# Altium schematic sheet CONTROL_BOARD.SchDoc
size 1249 x 800 mm; SheetNumber: 1; SheetTotal: 1
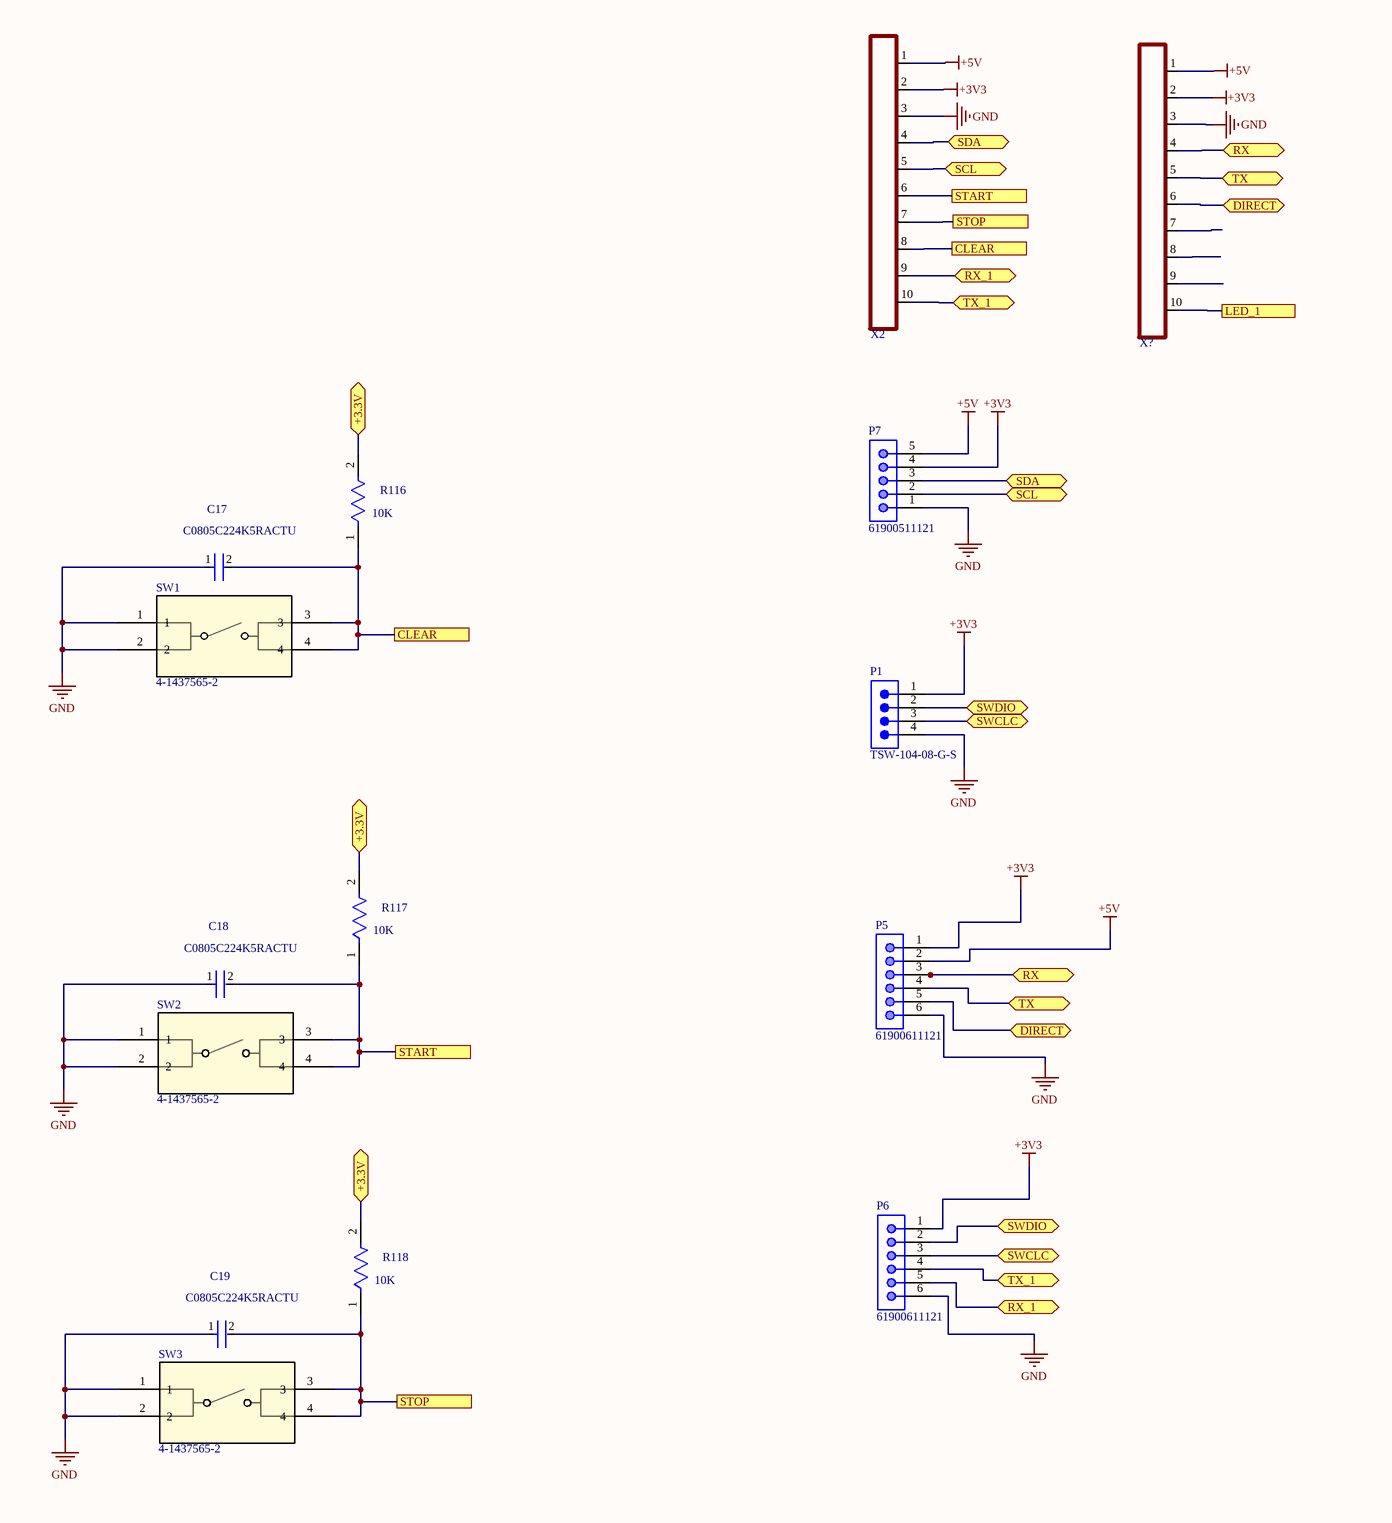
[diagram p0: CONTROL_BOARD.SchDoc, left]
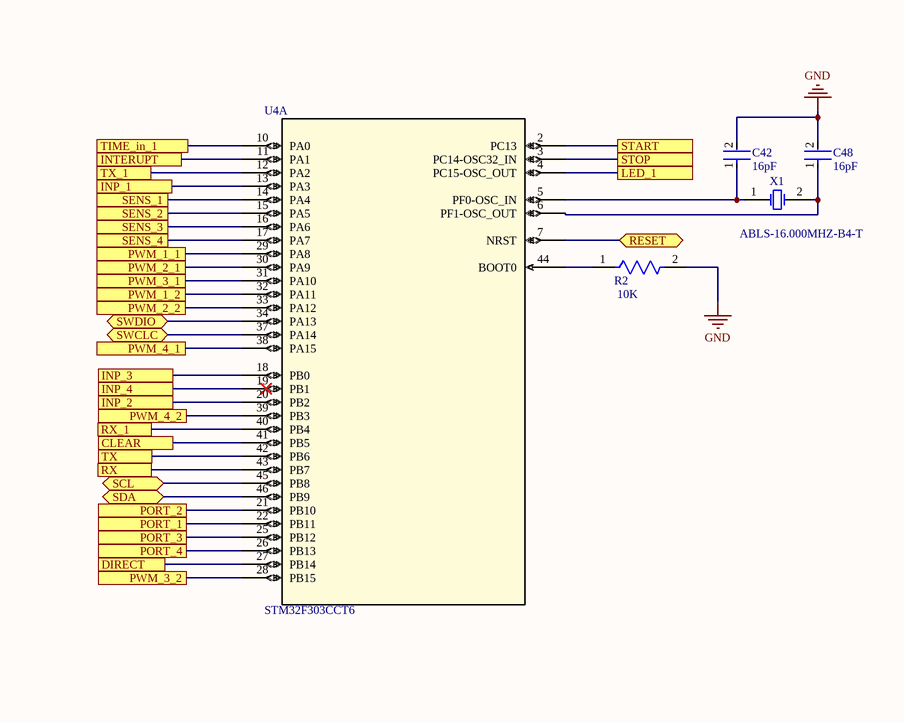
[diagram p1: CONTROL_BOARD.SchDoc, right]

## Parts
C17  C0805C224K5RACTU  [FP-C0805C-DN-IPC_A]
C18  C0805C224K5RACTU  [FP-C0805C-DN-IPC_A]
C19  C0805C224K5RACTU  [FP-C0805C-DN-IPC_A]
C42  16pF  [FP-C0805C-DN-MFG]
C48  16pF  [FP-C0805C-DN-MFG]
P1  TSW-104-08-G-S  [SMTC-TSW-104-08-X-S]
P5  61900611121  [61900611121]
P6  61900611121  [61900611121]
P7  61900511121  [61900511121]
R2  10K  [Vishay_CRCW0805-e3_IPC_A]
R116  10K  [FP-CRCW0805-e3-IPC_A]
R117  10K  [FP-CRCW0805-e3-IPC_A]
R118  10K  [FP-CRCW0805-e3-IPC_A]
SW1  4-1437565-2  [SW4_FSM-5P23_TEC]
SW2  4-1437565-2  [SW4_FSM-5P23_TEC]
SW3  4-1437565-2  [SW4_FSM-5P23_TEC]
U4  STM32F303CCT6  [LQFP48-7x7mm]  (part A of 2)
X1  ABLS-16.000MHZ-B4-T  [ABRA-ABLS-14.7456MHZ-B2-T_V]
X2  BH-10  [BH-10]  (value not drawn)
X?  BH-10  [BH-10]  (value not drawn)

## Ports
+3.3V (bidir), CLEAR, DIRECT, DIRECT (bidir), INP_1, INP_2, INP_3, INP_4, INTERUPT, LED_1, PORT_1, PORT_2, PORT_3, PORT_4, PWM_1_1, PWM_1_2, PWM_2_1, PWM_2_2, PWM_3_1, PWM_3_2, PWM_4_1, PWM_4_2, RESET (bidir), RX, RX (bidir), RX_1, RX_1 (bidir), SCL (bidir), SDA (bidir), SENS_1, SENS_2, SENS_3, SENS_4, START, STOP, SWCLC (bidir), SWDIO (bidir), TIME_in_1, TX, TX (bidir), TX_1, TX_1 (bidir)

## Nets
+3V3: P1.1 P5.1 P6.1 P7.4 X2.2 X?.2
+5V: P5.2 P7.5 X2.1 X?.1
GND: C17.1 C18.1 C19.1 C42.2 C48.2 P1.4 P5.6 P6.6 P7.1 R2.2 SW1.1 SW1.2 SW2.1 SW2.2 SW3.1 SW3.2 X2.3 X?.3
+3.3V: R116.2 R117.2 R118.2 ; port +3.3V
CLEAR: C17.2 R116.1 SW1.3 SW1.4 U4.41(PB5) X2.8 ; port CLEAR
DIRECT: P5.5 U4.27(PB14) X?.6 ; port DIRECT
INP_1: U4.13(PA3) ; port INP_1
INP_2: U4.20(PB2) ; port INP_2
INP_3: U4.18(PB0) ; port INP_3
INP_4: U4.19(PB1) ; port INP_4
INTERUPT: U4.11(PA1) ; port INTERUPT
LED_1: U4.4(PC15-OSC_OUT) X?.10 ; port LED_1
PORT_1: U4.22(PB11) ; port PORT_1
PORT_2: U4.21(PB10) ; port PORT_2
PORT_3: U4.25(PB12) ; port PORT_3
PORT_4: U4.26(PB13) ; port PORT_4
PWM_1_1: U4.29(PA8) ; port PWM_1_1
PWM_1_2: U4.32(PA11) ; port PWM_1_2
PWM_2_1: U4.30(PA9) ; port PWM_2_1
PWM_2_2: U4.33(PA12) ; port PWM_2_2
PWM_3_1: U4.31(PA10) ; port PWM_3_1
PWM_3_2: U4.28(PB15) ; port PWM_3_2
PWM_4_1: U4.38(PA15) ; port PWM_4_1
PWM_4_2: U4.39(PB3) ; port PWM_4_2
RESET: U4.7(NRST) ; port RESET
RX: P5.3 U4.43(PB7) X?.4 ; port RX
RX_1: P6.5 U4.40(PB4) X2.9 ; port RX_1
SCL: P7.2 U4.45(PB8) X2.5 ; port SCL
SDA: P7.3 U4.46(PB9) X2.4 ; port SDA
SENS_1: U4.14(PA4) ; port SENS_1
SENS_2: U4.15(PA5) ; port SENS_2
SENS_3: U4.16(PA6) ; port SENS_3
SENS_4: U4.17(PA7) ; port SENS_4
START: C18.2 R117.1 SW2.3 SW2.4 U4.2(PC13) X2.6 ; port START
STOP: C19.2 R118.1 SW3.3 SW3.4 U4.3(PC14-OSC32_IN) X2.7 ; port STOP
SWCLC: P1.3 P6.3 U4.37(PA14) ; port SWCLC
SWDIO: P1.2 P6.2 U4.34(PA13) ; port SWDIO
TIME_in_1: U4.10(PA0) ; port TIME_in_1
TX: P5.4 U4.42(PB6) X?.5 ; port TX
TX_1: P6.4 U4.12(PA2) X2.10 ; port TX_1
NetC42_1: C42.1 U4.5(PF0-OSC_IN) X1.1(X1)
NetC48_1: C48.1 U4.6(PF1-OSC_OUT) X1.2(X2)
NetR2_1: R2.1 U4.44(BOOT0)

Not connected (* = marked no-connect by the designer): X? 7 8 9

## Library data of the parts
C17-C19 = CMP-1036-04552-2: CAP CER 0.22UF 50V X7R 0805; Manufacturer: KEMET; Value: 0.22 μF; Temperature Coefficient: 30ppm/°C; Material: Ceramic; Tolerance: 0.1; ComponentLink2URL: https://content.kemet.com/datasheets/KEM_C1003_C0G_SMD.pdf; Temperature Characteristic: X7R; Device Class L3: Ceramic Capacitors; Lead Free: Yes; Temperature: -55°C to +125°C; RoHS: TRUE; Capacitance: 0.22 μF; Automotive: No; Octopart: https://octopart.com/c0805c224k5ractu-kemet-144670; Manufacturer Part Number: C0805C224K5RACTU; Temperature Range Low: -55°C; Height: 0.88mm; Device Class L1: Passive Components; Digikey Description: CAP CER 0.22UF 50V X7R 0805; ComponentLink2Description: Datasheet; Mouser Description: CAP CER 0.22UF 50V X7R 0805; Category: Cap; Ipc Land Pattern Name: CAPC200125X78; Temperature Range High: +125°C; Package: C0805C-DN; Device Class L2: Capacitors; Voltage Rating: 50 V
C42 C48 = CMP-1036-04552-2: CAP CER 16pF 50V X7R 0805; Manufacturer: KEMET; Manufacturer Part Number: C0805C224K5RACTU; Value: 0.22 μF; Temperature Coefficient: 30ppm/°C; Material: Ceramic; Tolerance: 0.1; ComponentLink2URL: https://content.kemet.com/datasheets/KEM_C1003_C0G_SMD.pdf; Temperature Characteristic: X7R; Device Class L3: Ceramic Capacitors; Lead Free: Yes; Temperature: -55°C to +125°C; RoHS: TRUE; Capacitance: 0.22 μF; Automotive: No; Octopart: https://octopart.com/c0805c224k5ractu-kemet-144670; Temperature Range Low: -55°C; Height: 0.88mm; Device Class L1: Passive Components; Digikey Description: CAP CER 0.22UF 50V X7R 0805; ComponentLink2Description: Datasheet; Mouser Description: CAP CER 0.22UF 50V X7R 0805; Category: Cap; Ipc Land Pattern Name: CAPC200125X78; Temperature Range High: +125°C; Package: C0805C-DN; Device Class L2: Capacitors; Voltage Rating: 50 V
P1 = CMP-1024-00357-1: 0.025" SQ Post Header, Through-hole, Vertical, -55 to 125 degC, 2.54 mm Pitch, 4-Pin, Male, RoHS; Manufacturer: Samtec; Pitch: 2.54 mm; RoHS: True; ComponentLink3URL: http://www.samtec.com/documents/webfiles/cpdf/TSW-XXX-XX-XXX-X-XX-XXX-MKT.pdf; Mounting Technology: Through-hole; ComponentLink2URL: http://www.samtec.com/documents/webfiles/pdf/TSW_TH.PDF; ComponentLink1URL: http://www.samtec.com; ComponentLink3Description: Package Specification; PackageVersion: DM, 8/1988; ComponentLink2Description: Datasheet; PackageReference: TSW-104-08-X-S; PackageDescription: .025[0.64] SQ. Post Terminal Strip Assembly; PartNumber: TSW-104-08-G-S; ComponentLink1Description: Manufacturer URL; Temperature Range: -55 to 125 degC; DatasheetVersion: F-214; Orientation: Vertical
P5 P6 = 61900611121: WR-WTB THT Male Vertical Locking Header, pitch 2.54mm, 6p; Pin Number: 6; Contact Resistance: 20mOhm; Rated Current: 3A; Withstanding Voltage: 1000VAC; Working Voltage: 250VAC; ComponentLink1Description: Manufacturer; ComponentLink1URL: http://www.we-online.de; ComponentLink2Description: Datasheet; ComponentLink2URL: https://www.we-online.com/catalog/datasheet/61900611121.pdf; Pitch: 2.54mm; Published Date: January 2020; Publisher: Wurth Elektronik; Mounting Technology: THT; Packaging: Bag; Operating Temperature: -40 to +105degC; Part Number: 61900611121; Gender: Male; Type: Vertical
P7 = 61900511121: WR-WTB THT Male Vertical Locking Header, pitch 2.54mm, 5p; Pin Number: 5; Contact Resistance: 20mOhm; Rated Current: 3A; Withstanding Voltage: 1000VAC; Working Voltage: 250VAC; ComponentLink1Description: Manufacturer; ComponentLink1URL: http://www.we-online.de; ComponentLink2Description: Datasheet; ComponentLink2URL: https://www.we-online.com/catalog/datasheet/61900511121.pdf; Pitch: 2.54mm; Published Date: January 2020; Publisher: Wurth Elektronik; Mounting Technology: THT; Packaging: Bag; Operating Temperature: -40 to +105degC; Part Number: 61900511121; Gender: Male; Type: Vertical
R2 = CRCW08050000Z0EA
R116-R118 = CMP-2001-04908-2: RES Thick Film, 10kΩ, 1%, 0.125W, 100ppm/°C, 0805; Resistance: 10kR; Voltage Rating (DC): 150V; Power Rating: 125mW; Weight: 0.000194oz; Package Quantity: 5000; Military Standard: Not; Max Operating Temperature: 155°C; Temperature Coefficient: 100ppm/°C; Contact Plating: Tin; Width: 1.25mm; Height: 0.45mm; Radiation Hardening: No; Tolerance: 1%; Min Operating Temperature: -55°C; Voltage Rating: 150V; Length: 2mm; Depth: 1.25mm; Termination: SMD/SMT; Packaging: Tape and Reel; Case/Package: 0805; Case Code (Metric): 2012; Lead Free: Lead Free; Case Code (Imperial): 0805; Composition: Thick Film
SW1-SW3 = 4-1437565-2: No Description Available; Mfr_Name: TE Connectivity; Copyright: Copyright (C) 2022 Ultra Librarian. All rights reserved.; Manufacturer_Part_Number: 4-1437565-2; RefDes: RefDes; Type: DEV
U4 = STM32F303CCT6: No Description Available; Mfr_Name: STMicroelectronics; RefDes: RefDes; Type: Type
X1 = CMP-2000-05726-1: Low Profile Crystal, 16.0 MHz, +/- 30 ppm, -20 to 70 degC, 2-Pin SMD, RoHS, Tape and Reel; Brand: ABRACON; Case Length: 11.4mm; Frequency Stability: 50PPM; ESR: 80Ohms; Case Height: 4.2mm; Tolerance: 30PPM; Frequency: 8MHz; Case Width: 4.7mm; Load Capacitance: 18pF; Datasheet Version: 04/2011; Termination Style: SMD/SMT; Dimensions: 4.7mmWx11.4mmLx4.2mmH; Packaging: Reel; Manufacturer: ABRACON; Package URL: http://www.abracon.com/Support/PackageDrawing/Resonators/ABLS-2D.pdf; Mounting Technology: SurfaceMount; Package Reference: ABLS-14.7456MHZ-B2-T; Product Category: Crystals; Package Description: 2-Pin Surface Mount Device, Body 11.4 x 4.7 mm; Package / Case: HC-49/US; Mounting Style: SMD/SMT; Operating Temperature Range: -20Cto+70C; Series: ABLS; Factory Pack Quantity: 1000; Datasheet URL: http://www.abracon.com/Resonators/abls.pdf; Manufacturer URL: http://www.abracon.com/; RoHS: Details; Type: LowProfileMicroprocessorCrystal